# Altium schematic sheet LAN9514.SchDoc
size A2
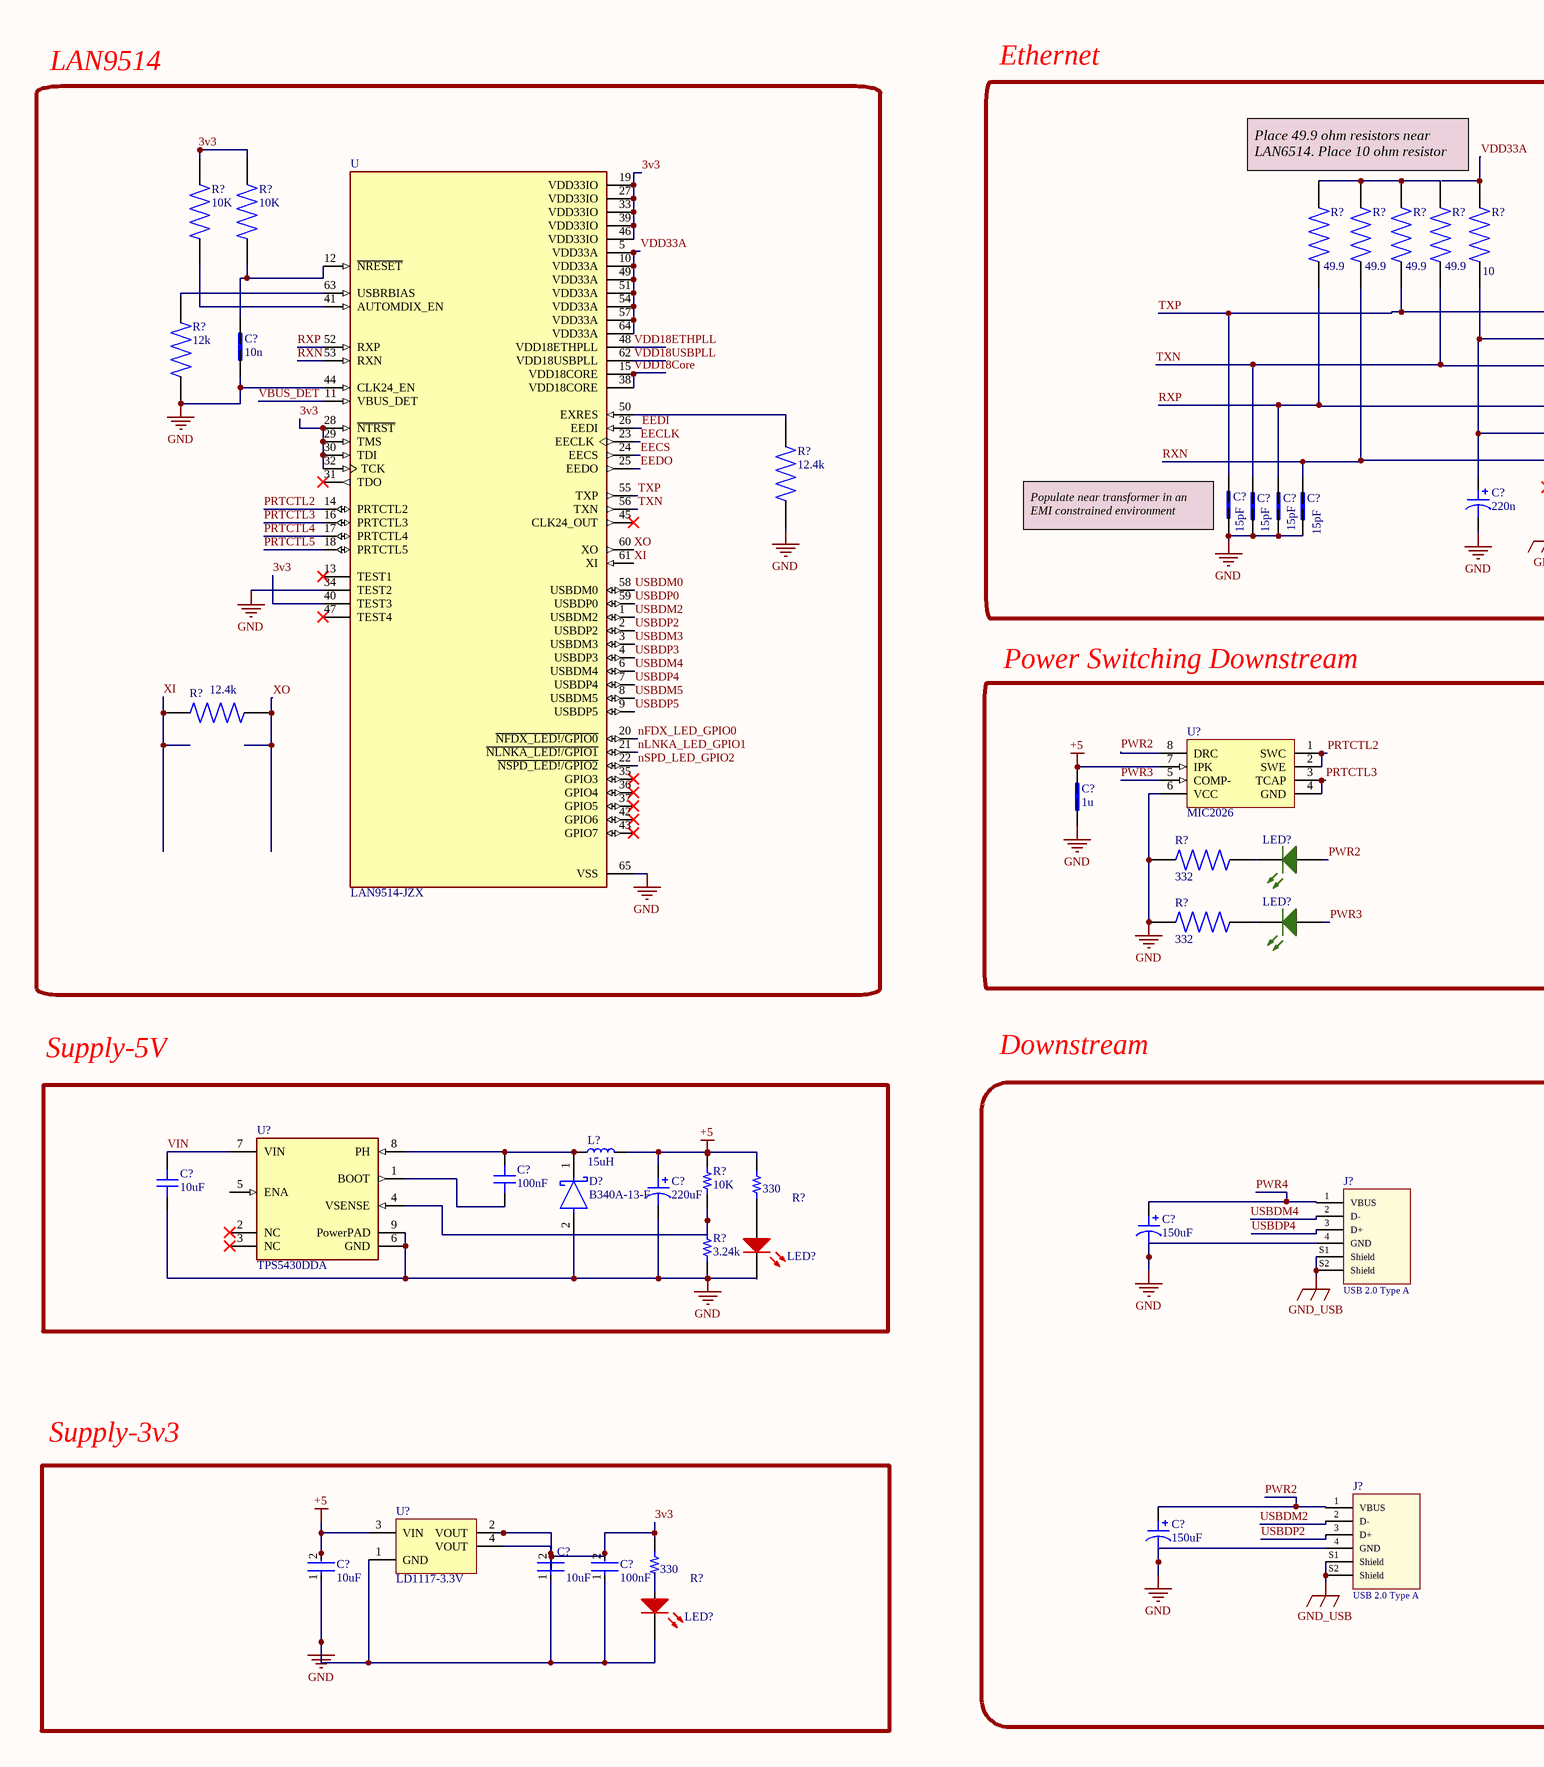
[diagram p0: LAN9514.SchDoc, left]
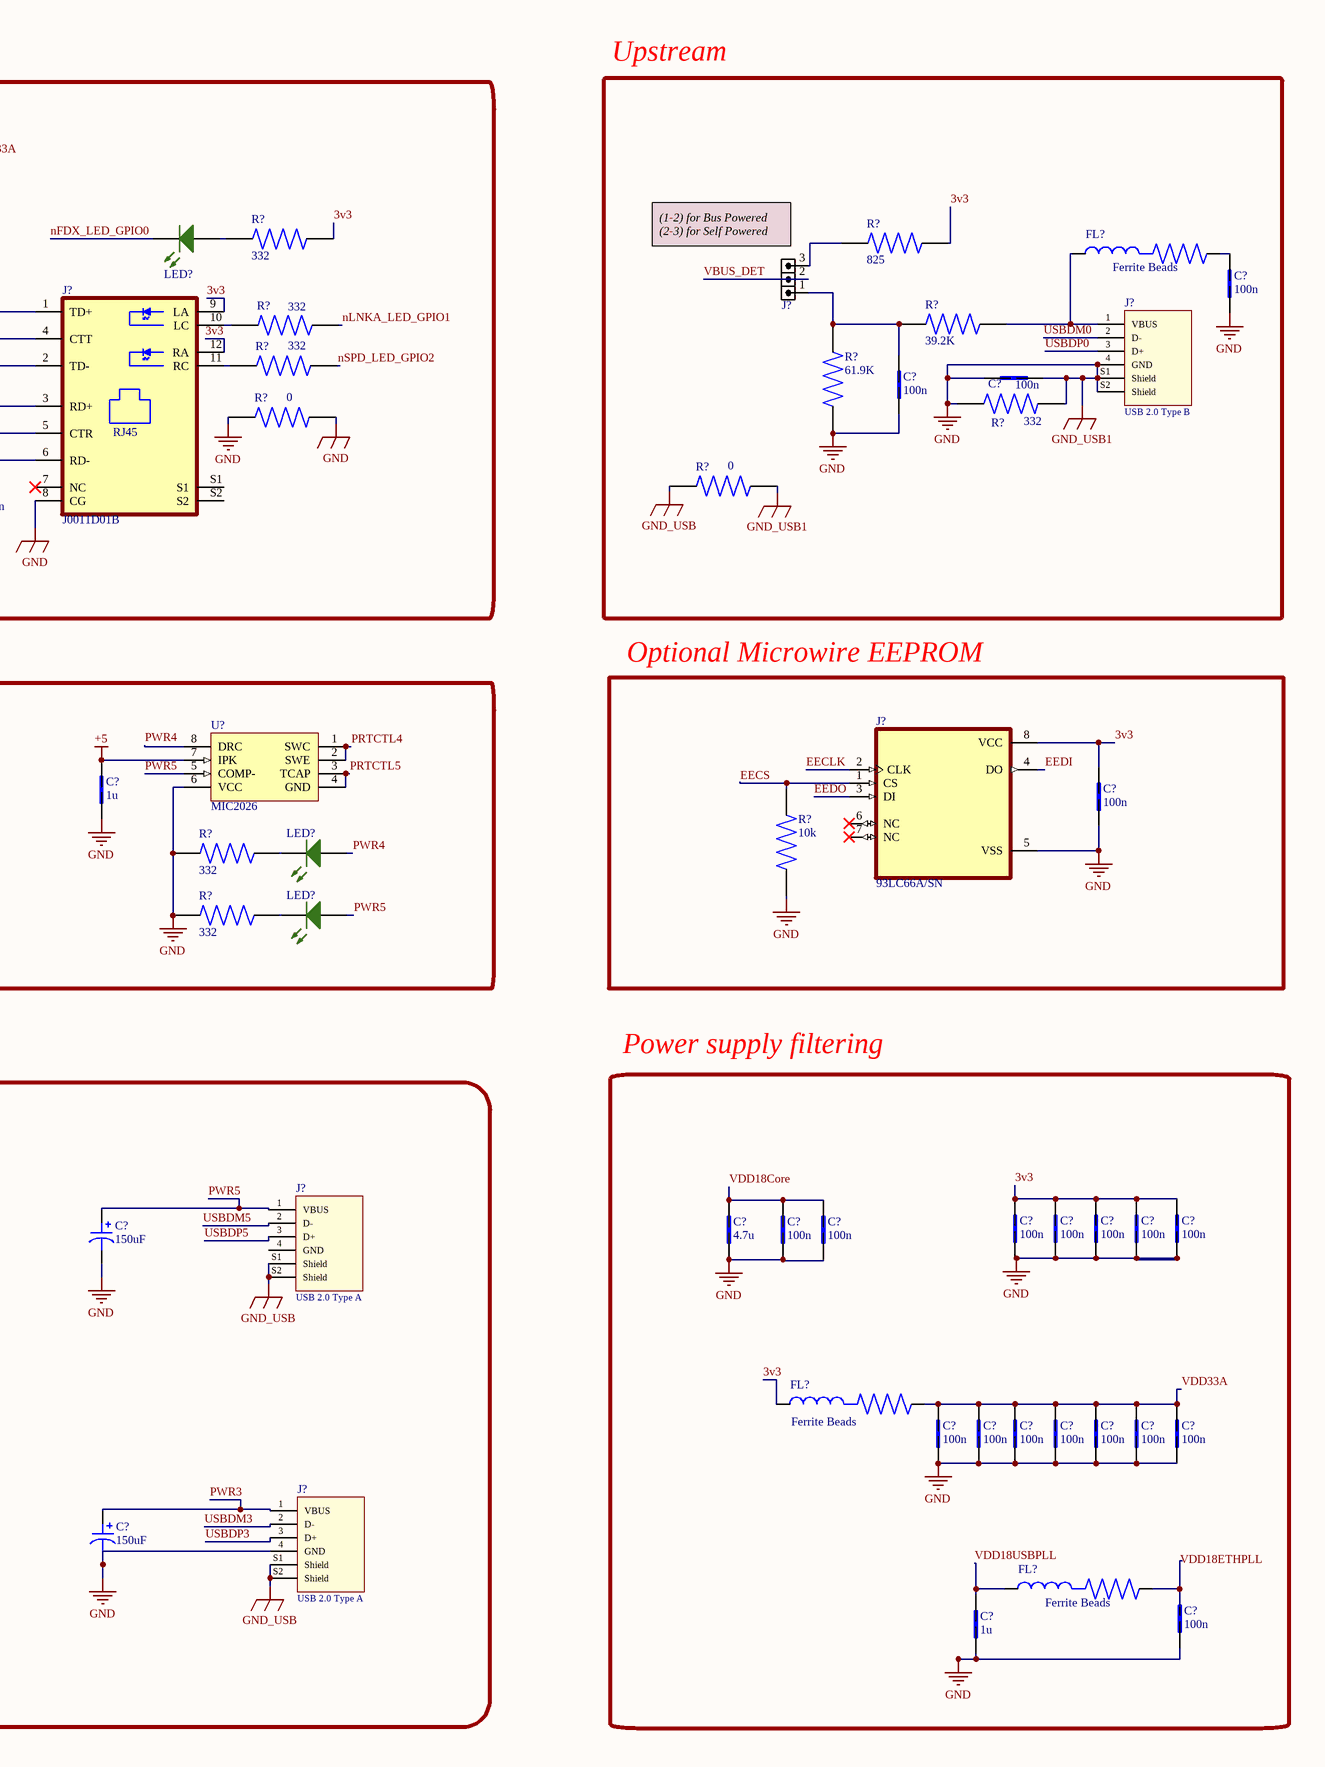
[diagram p1: LAN9514.SchDoc, right]

## Parts
(Parts that share a designator on the sheet are numbered #1, #2 ... from top to bottom, then left to right.)
C?#1  100n  [CAPC2012X140N]
C?#2  10n  [CAPC2012X140N]
C?#3  100n  [CAPC2012X140N]
C?#4  100n  [CAPC2012X140N]
C?#5  15pF  [CAPC2012X140N]
C?#6  15pF  [CAPC2012X140N]
C?#7  15pF  [CAPC2012X140N]
C?#8  15pF  [CAPC2012X140N]
C?#9  220n  [CAP TANSMD 1206_3216 CASE A]
C?#10  1u  [CAPC2012X140N]
C?#11  1u  [CAPC2012X140N]
C?#12  100n  [CAPC2012X140N]
C?#13  100nF  [CAP 0805_2012]
C?#14  10uF  [CAP 0805_2012]
C?#15  220uF  [CAP TANSMD 1206_3216 CASE A]
C?#16  100n  [CAPC2012X140N]
C?#17  100n  [CAPC2012X140N]
C?#18  100n  [CAPC2012X140N]
C?#19  100n  [CAPC2012X140N]
C?#20  100n  [CAPC2012X140N]
C?#21  150uF  [CAP TANSMD 1206_3216 CASE A]
C?#22  4.7u  [CAPC2012X140N]
C?#23  100n  [CAPC2012X140N]
C?#24  100n  [CAPC2012X140N]
C?#25  150uF  [CAP TANSMD 1206_3216 CASE A]
C?#26  100n  [CAPC2012X140N]
C?#27  100n  [CAPC2012X140N]
C?#28  100n  [CAPC2012X140N]
C?#29  100n  [CAPC2012X140N]
C?#30  100n  [CAPC2012X140N]
C?#31  100n  [CAPC2012X140N]
C?#32  100n  [CAPC2012X140N]
C?#33  150uF  [CAP TANSMD 1206_3216 CASE A]
C?#34  150uF  [CAP TANSMD 1206_3216 CASE A]
C?#35  10uF  [FP-C0805C-DN-MFG]
C?#36  10uF  [FP-C0805C-DN-MFG]
C?#37  100nF  [FP-C0805C-DN-MFG]
C?#38  100n  [CAPC2012X140N]
C?#39  1u  [CAPC2012X140N]
D?  B340A-13-F  [FP-SMA-MFG]
FL?#1  Ferrite Beads  [FIL_NFZ32BW291HZ10L]
FL?#2  Ferrite Beads  [FIL_NFZ32BW291HZ10L]
FL?#3  Ferrite Beads  [FIL_NFZ32BW291HZ10L]
J?#1  HDRM3  [HDR_1X3]  (value not drawn)
J?#2  USB 2.0 Type B  [62910416121]
J?#3  J0011D01B  [J0-A/B/F]
J?#4  93LC66A/SN  [SOIC127P600X175-8N]
J?#5  USB 2.0 Type A  [62900416021]
J?#6  USB 2.0 Type A  [62900416021]
J?#7  USB 2.0 Type A  [62900416021]
J?#8  USB 2.0 Type A  [62900416021]
L?  15uH  [IND 0805_2012]
LED?#1  LED SMD 0805 GREEN  [LED_0805_GREEN]  (value not drawn)
LED?#2  LED SMD 0805 GREEN  [LED_0805_GREEN]  (value not drawn)
LED?#3  LED SMD 0805 GREEN  [LED_0805_GREEN]  (value not drawn)
LED?#4  LED SMD 0805 GREEN  [LED_0805_GREEN]  (value not drawn)
LED?#5  LED SMD 0805 GREEN  [LED_0805_GREEN]  (value not drawn)
LED?#6  LED SMD 0805 RED  [LED_0805_RED]  (value not drawn)
LED?#7  LED SMD 0805 RED  [LED_0805_RED]  (value not drawn)
R?#1  10K  [RESC2012X60N]
R?#2  10K  [RESC2012X60N]
R?#3  49.9  [RESC2012X60N]
R?#4  49.9  [RESC2012X60N]
R?#5  49.9  [RESC2012X60N]
R?#6  49.9  [RESC2012X60N]
R?#7  10  [RESC2012X60N]
R?#8  332  [RESC2012X60N]
R?#9  825  [RESC2012X60N]
R?#10  39.2K  [RESC2012X60N]
R?#11  332  [RESC2012X60N]
R?#12  12k  [RESC2012X60N]
R?#13  332  [RESC2012X60N]
R?#14  61.9K  [RESC2012X60N]
R?#15  332  [RESC2012X60N]
R?#16  0  [RESC2012X60N]
R?#17  12.4k  [RESC2012X60N]
R?#18  0  [RESC2012X60N]
R?#19  12.4k  [RESC2012X60N]
R?#20  10k  [RESC2012X60N]
R?#21  332  [RESC2012X60N]
R?#22  332  [RESC2012X60N]
R?#23  332  [RESC2012X60N]
R?#24  332  [RESC2012X60N]
R?#25  10K  [RES 0805_2012]
R?#26  330  [RES 0805_2012]
R?#27  3.24k  [RES 0805_2012]
R?#28  330  [RES 0805_2012]
U  LAN9514-JZX  [QFN50P900X900X100-65N730X730]
U?#1  MIC2026  [SOIC-8 4.9X3.9MM P1.27MM]
U?#2  MIC2026  [SOIC-8 4.9X3.9MM P1.27MM]
U?#3  TPS5430DDA  [FP-DDA0008J-MFG]
U?#4  LD1117-3.3V  [SOT-223-4 6.5X7MM P2.3MM]

## Blocks framed on the sheet
Ethernet: C?#5-C?#9 J?#3 LED?#1 R?#3-R?#8 R?#11 R?#13 R?#16
Upstream: C?#1 C?#3 C?#4 FL?#1 J?#1 J?#2 R?#9 R?#10 R?#14 R?#15 R?#18
LAN9514: C?#2 R?#1 R?#2 R?#12 R?#17 R?#19 U
Optional Microwire EEPROM: C?#12 J?#4 R?#20
Power Switching Downstream: C?#10 C?#11 LED?#2-LED?#5 R?#21-R?#24 U?#1 U?#2
Power supply filtering: C?#16-C?#20 C?#22-C?#24 C?#26-C?#32 C?#38 C?#39 FL?#2 FL?#3
Supply-3v3: C?#35-C?#37 LED?#7 R?#28 U?#4

## Nets
+5: C?#10.2 C?#11.2 C?#15.1 C?#35.2 L?.2 R?#25.2 R?#26.1 U?#1.7(IPK) U?#2.7(IPK) U?#4.3(VIN)
GND: C?#1.1 C?#2.1 C?#3.1 C?#3.2 C?#4.1 C?#5.1 C?#6.1 C?#7.1 C?#8.1 C?#9.2 C?#10.1 C?#11.1 C?#12.1 C?#14.1 C?#15.2 C?#16.1 C?#17.1 C?#18.1 C?#19.1 C?#20.1 C?#21.2 C?#22.1 C?#23.1 C?#24.1 C?#25.2 C?#26.1 C?#27.1 C?#28.1 C?#29.1 C?#30.1 C?#31.1 C?#32.1 C?#33.2 C?#34.2 C?#35.1 C?#36.1 C?#37.1 C?#38.1 C?#39.1 D?.2(A) J?#2.4(GND) J?#2.S1(Shield) J?#2.S2(Shield) J?#3.8(CG) J?#4.5(VSS) J?#5.4(GND) J?#7.4(GND) J?#8.4(GND) LED?#6.2(K) LED?#7.2(K) R?#12.1 R?#14.2 R?#15.1 R?#15.2 R?#16.1 R?#16.2 R?#17.1 R?#18.1 R?#20.1 R?#21.2 R?#22.2 R?#23.2 R?#24.2 R?#27.1 U.34(TEST2) U.44(CLK24_EN) U.65(VSS) U?#1.6(VCC) U?#2.6(VCC) U?#3.6(GND) U?#3.9(PowerPAD) U?#4.1(GND)  [also labelled GND_USB1]
GND_USB: J?#5.S1(Shield) J?#5.S2(Shield) J?#6.S1(Shield) J?#6.S2(Shield) J?#7.S1(Shield) J?#7.S2(Shield) J?#8.S1(Shield) J?#8.S2(Shield) R?#18.2
3v3: C?#12.2 C?#16.2 C?#17.2 C?#18.2 C?#19.2 C?#20.2 C?#36.2 C?#37.2 FL?#2.1 J?#3.9(LA) J?#3.12(RA) J?#4.8(VCC) R?#1.2 R?#2.2 R?#8.1 R?#9.2 R?#28.1 U.19(VDD33IO) U.27(VDD33IO) U.28(~{NTRST}) U.29(TMS) U.30(TDI) U.32(TCK) U.33(VDD33IO) U.39(VDD33IO) U.40(TEST3) U.46(VDD33IO) U?#4.2(VOUT) U?#4.4(VOUT)
EECLK: J?#4.2(CLK) U.23(EECLK)
EECS: J?#4.1(CS) R?#20.2 U.24(EECS)
EEDI: J?#4.4(DO) U.26(EEDI)
EEDO: J?#4.3(DI) U.25(EEDO)
nFDX_LED_GPIO0: LED?#1.2(K) U.20(~{NFDX_LED!/GPIO0})
nLNKA_LED_GPIO1: R?#11.2 U.21(~{NLNKA_LED!/GPIO1})
nSPD_LED_GPIO2: R?#13.1 U.22(~{NSPD_LED!/GPIO2})
PRTCTL2: U.14(PRTCTL2) U?#2.1(SWC) U?#2.2(SWE)
PRTCTL3: U.16(PRTCTL3) U?#2.3(TCAP) U?#2.4(GND)
PRTCTL4: U.17(PRTCTL4) U?#1.1(SWC) U?#1.2(SWE)
PRTCTL5: U.18(PRTCTL5) U?#1.3(TCAP) U?#1.4(GND)
PWR2: C?#33.1 J?#7.1(VBUS) LED?#3.1(A) U?#2.8(DRC)
PWR3: C?#34.1 J?#8.1(VBUS) LED?#5.1(A) U?#2.5(COMP-)
PWR4: C?#21.1 J?#5.1(VBUS) LED?#2.1(A) U?#1.8(DRC)
PWR5: C?#25.1 J?#6.1(VBUS) LED?#4.1(A) U?#1.5(COMP-)
RXN: C?#8.2 J?#3.6(RD-) R?#4.1 U.53(RXN)
RXP: C?#7.2 J?#3.3(RD+) R?#3.1 U.52(RXP)
TXN: C?#6.2 J?#3.2(TD-) R?#6.1 U.56(TXN)
TXP: C?#5.2 J?#3.1(TD+) R?#5.1 U.55(TXP)
USBDM0: J?#2.2(D-) U.58(USBDM0)
USBDM2: J?#7.2(D-) U.1(USBDM2)
USBDM3: J?#8.2(D-) U.3(USBDM3)
USBDM4: J?#5.2(D-) U.6(USBDM4)
USBDM5: J?#6.2(D-) U.8(USBDM5)
USBDP0: J?#2.3(D+) U.59(USBDP0)
USBDP2: J?#7.3(D+) U.2(USBDP2)
USBDP3: J?#8.3(D+) U.4(USBDP3)
USBDP4: J?#5.3(D+) U.7(USBDP4)
USBDP5: J?#6.3(D+) U.9(USBDP5)
VBUS_DET: J?#1.2 U.11(VBUS_DET)
VDD18Core: C?#22.2 C?#23.2 C?#24.2 U.15(VDD18CORE) U.38(VDD18CORE)
VDD18ETHPLL: C?#38.2 FL?#3.2 U.48(VDD18ETHPLL)
VDD18USBPLL: C?#39.2 FL?#3.1 U.62(VDD18USBPLL)
VDD33A: C?#26.2 C?#27.2 C?#28.2 C?#29.2 C?#30.2 C?#31.2 C?#32.2 FL?#2.2 R?#7.2 U.5(VDD33A) U.10(VDD33A) U.49(VDD33A) U.51(VDD33A) U.54(VDD33A) U.57(VDD33A) U.64(VDD33A)
VIN: C?#14.2 U?#3.7(VIN)
XI: R?#19.1 U.61(XI)
XO: R?#19.2 U.60(XO)
NetC?#1_2: C?#1.2 FL?#1.2
NetC?#2_2: C?#2.2 R?#2.1 U.12(~{NRESET})
NetC?#4_2: C?#4.2 J?#1.1 R?#10.1 R?#14.1
NetC?#9_1: C?#9.1 J?#3.4(CTT) J?#3.5(CTR) R?#7.1
NetC?#13_1: C?#13.1 U?#3.1(BOOT)
NetC?#13_2: C?#13.2 D?.1(C) L?.1 U?#3.8(PH)
NetFL?#1_1: FL?#1.1 J?#2.1(VBUS) R?#10.2
NetJ?#1_3: J?#1.3 R?#9.1
NetJ?#3_10: J?#3.10(LC) R?#11.1
NetJ?#3_11: J?#3.11(RC) R?#13.2
NetLED?#1_1: LED?#1.1(A) R?#8.2
NetLED?#2_2: LED?#2.2(K) R?#21.1
NetLED?#3_2: LED?#3.2(K) R?#22.1
NetLED?#4_2: LED?#4.2(K) R?#23.1
NetLED?#5_2: LED?#5.2(K) R?#24.1
NetLED?#6_1: LED?#6.1(A) R?#26.2
NetLED?#7_1: LED?#7.1(A) R?#28.2
NetR?#1_1: R?#1.1 U.41(AUTOMDIX_EN)
NetR?#3_2: R?#3.2 R?#4.2 R?#5.2 R?#6.2
NetR?#12_2: R?#12.2 U.63(USBRBIAS)
NetR?#17_2: R?#17.2 U.50(EXRES)
NetR?#25_1: R?#25.1 R?#27.2 U?#3.4(VSENSE)

Not connected (* = marked no-connect by the designer): J?#3 7(NC)* S1 S2; J?#4 6(NC)* 7(NC)*; J?#6 4(GND); U 13(TEST1)* 31(TDO)* 35(GPIO3)* 36(GPIO4)* 37(GPIO5)* 42(GPIO6)* 43(GPIO7)* 45(CLK24_OUT)* 47(TEST4)*; U?#3 2(NC)* 3(NC)* 5(ENA)

## Notes on the sheet
- (near R?#6) Place 49.9 ohm resistors near LAN6514. Place 10 ohm resistor near transformer
- (near J?#1) (1-2) for Bus Powered (2-3) for Self Powered
- (near C?#5) Populate near transformer in an EMI constrained environment
- Supply-5V
- Downstream
- Title
- Size:
- Date:
- File:
- A2
- Number:
- Time:
- Revision:
- Sheet
- of
- (in symbol J0011D01B) RJ45

## Library data of the parts
C?#1-C?#8 C?#10-C?#12 C?#16-C?#20 C?#22-C?#24 C?#26-C?#32 C?#38 C?#39 = LD051C182KAB2A: COMMERCIAL CHIP STD JAPAN BULK - FN TAPE/REEL, 7 INCH PAPER TAPE; Package: None; Price: None; Value: *; MP: LD051C182KAB2A; Availability: Unavailable
C?#9 C?#15 C?#21 C?#25 C?#33 C?#34 = Cap Tan Case A: SMT Tantalum Capacitor; VALUE: 10uF 6.3V
C?#13 = Cap 0805: SMT Capacitor; VALUE: 100nF
C?#14 = Cap 0805: SMT Capacitor; VALUE: 100nF
C?#35-C?#37 = CMP-1036-04552-2: CAP CER 0.22UF 50V X7R 0805; Manufacturer: KEMET; Manufacturer Part Number: C0805C224K5RACTU; Value: 0.22 μF; Temperature Coefficient: 30ppm/°C; Material: Ceramic; Tolerance: 0.1; ComponentLink2URL: https://content.kemet.com/datasheets/KEM_C1003_C0G_SMD.pdf; Temperature Characteristic: X7R; Device Class L3: Ceramic Capacitors; Lead Free: Yes; Temperature: -55°C to +125°C; RoHS: TRUE; Capacitance: 0.22 μF; Automotive: No; Octopart: https://octopart.com/c0805c224k5ractu-kemet-144670; Temperature Range Low: -55°C; Height: 0.88mm; Device Class L1: Passive Components; Digikey Description: CAP CER 0.22UF 50V X7R 0805; ComponentLink2Description: Datasheet; Mouser Description: CAP CER 0.22UF 50V X7R 0805; Category: Cap; Ipc Land Pattern Name: CAPC200125X78; Temperature Range High: +125°C; Package: C0805C-DN; Device Class L2: Capacitors; Voltage Rating: 50 V
D? = CMP-1667-00003-3: DIODE SCHOTTKY 40V 3A SMA; Max Forward Surge Current (Ifsm): 80A; Forward Voltage: 500mV; Polarity: Standard; Max Reverse Current: 500uA; Capacitance: 250pF; Element Configuration: Single; Mount: Surface Mount; Output Current: 3A; Radiation Hardening: No; Width: 2.92mm; Current Rating: 3A; Termination: SMD/SMT; Voltage: 40V; Series: -; Max Operating Temperature: 125°C; Current: 3A; Max Repetitive Reverse Voltage (Vrrm): 40V; Min Operating Temperature: -55°C; REACH SVHC: No SVHC; Number of Pins: 2; Average Rectified Current: 3A; Contact Plating: Tin; RoHS Compliant: Yes; Max Reverse Voltage (DC): 40V; Packaging: Tape and Reel; Height: 2.3mm; Length: 4.6mm; Case/Package: SMA; Weight: 0.002258oz; Peak Non-Repetitive Surge Current: 80A; Package Quantity: 5000; Lead Free: Lead Free; Forward Current: 3A; Voltage Rating (DC): 40V
FL?#1-FL?#3 = NFZ32BW291HZ10L: Ferrite Bead 100 Ohm 2smd 1ln; Package: None; Price: None; Value: *; MP: NFZ32BW291HZ10L; Availability: Unavailable
J?#1 = HDR_1X3: CONN, HEADER, Male, pitch: 2.54mm, 3POS; VALUE: HDRM3
J?#2 = USB 2.0 Type B Horizontal (SMD) 62910416121: USB 2.0 Type B Horizontal SMT with Pads and Pegs WR-COM; Rated Current: 1.5 A; Gender: Female; ComponentLink1Description: Manufacturer; ComponentLink1URL: http://www.we-online.de; ComponentLink2Description: Datasheet; ComponentLink2URL: http://katalog.we-online.de/em/datasheet/62910416121.pdf; PartNumber: 62910416121; Published Date: May 2018; Publisher: Wurth Elektronik; Orientation: Horizontal; Interface Type: USB 2.0 Type B; Operating Temperature: -40 to 105 degC; Mounting Technology: SMT; Packaging: Tape and Reel
J?#3 = J0011D01B: 1 Port RJ45 Magjack Connector Through Hole 10/100 Base-TX, AutoMDIX; MF: Pulse Electronics; Value: *; Purchase-URL: https://pricing.snapeda.com/search/part/J0011D01B/?ref=eda; Price: None; Package: None; Check_prices: https://www.snapeda.com/parts/J0011D01B/Pulse+Electronics+Network/view-part/?ref=eda; SnapEDA_Link: https://www.snapeda.com/parts/J0011D01B/Pulse+Electronics+Network/view-part/?ref=snap; Availability: In Stock; MP: J0011D01B
J?#5-J?#8 = USB 2.0 Type A Horizontal (SMD) 62900416021: USB 2.0 Type A Horizontal SMT WR-COM; Rated Current: 1.5 A; Gender: Female; ComponentLink1Description: Manufacturer; ComponentLink1URL: http://www.we-online.de; ComponentLink2Description: Datasheet; ComponentLink2URL: http://katalog.we-online.de/em/datasheet/62900416021.pdf; PartNumber: 62900416021; Published Date: May 2018; Publisher: Wurth Elektronik; Orientation: Horizontal; Interface Type: USB 2.0 Type A; Operating Temperature: -40 to 105 degC; Mounting Technology: SMT; Packaging: Tray
L? = Ind 0805: SMT Inductor; Value: 15uH
R?#1-R?#24 = AT0805BRD0720KL: RES SMD 20K OHM 0.1% 1/8W 0805; Package: None; Price: None; Value: *; MP: AT0805BRD0720KL; Availability: Unavailable
R?#25-R?#28 = Res 0805: SMT Resistor; VALUE: 1K
U = LAN9514-JZX: Ethernet Bridge, USB to Ethernet USB 2.0, 10/100 Base-T/TX PHY USB Interface 64-QFN _9x9_; MF: Microchip; MP: LAN9514-JZX; Availability: Unavailable; SnapEDA_Link: https://www.snapeda.com/parts/LAN9514-JZX/Microchip/view-part/105106/?ref=snap; Package: QFN-64 Microchip; Value: *; Price: None
U?#1 U?#2 = MC34063 (SMD): Buck, Boost Switching Regulator IC Positive or Negative Adjustable 1.25V 1 Output 1.5A (Switch) 8-SOIC (0.154", 3.90mm Width); PartNumber: MC34063EBD-TR
U?#3 = CMP-2000-04960-2: IC REG BUCK ADJUSTABLE 3A 8SOPWR; Manufacturer: Texas Instruments; Max Junction Temp: +125°C; Max Supply Voltage: 36V; Switching Frequency: 500kHz; Output Type: AdjustableProgrammable; Standoff Height: 0mm; Output Voltage: 1.23-31V; Max Duty Cycle: 89%; Nominal Supply Current: 3mA; Min Supply Voltage: 5.5V; Number Of Outputs: 1; Temperature: -40°C to +125°C; Temperature Range High: +125°C; Manufacturer Part Number: TPS5430DDA; Device Class L3: Voltage Regulators - Switching; Mouser Description: Voltage Regulators - Switching Regulators 5.5 to 36V Input 3A Step Dwn Converter; Switching Topology: Buck; ComponentLink2URL: http://www.ti.com/lit/ds/symlink/tps5431.pdf; ComponentLink2Description: Datasheet; Device Class L2: Power Management ICs; Device Class L1: Integrated Circuits (ICs); Digikey Description: IC REG BUCK ADJUSTABLE 3A 8SOPWR; RoHS: TRUE; Octopart: https://octopart.com/tps5430dda-texas+instruments-589977; Output Current: 3A; Automotive: No; Lead Free: Yes; Category: IC; Package: DDA0008J; Temperature Range Low: -40°C; Height: 1.7mm
U?#4 = LD1117-3.3V (SMD SOT-223): Linear Voltage Regulator IC  1 Output  800mA SOT-223; PartNumber: LD1117S33CTR
J?#4 = 93LC66A/SN: Package: None; Price: None; Value: *; MP: 93LC66A/SN; Availability: Unavailable